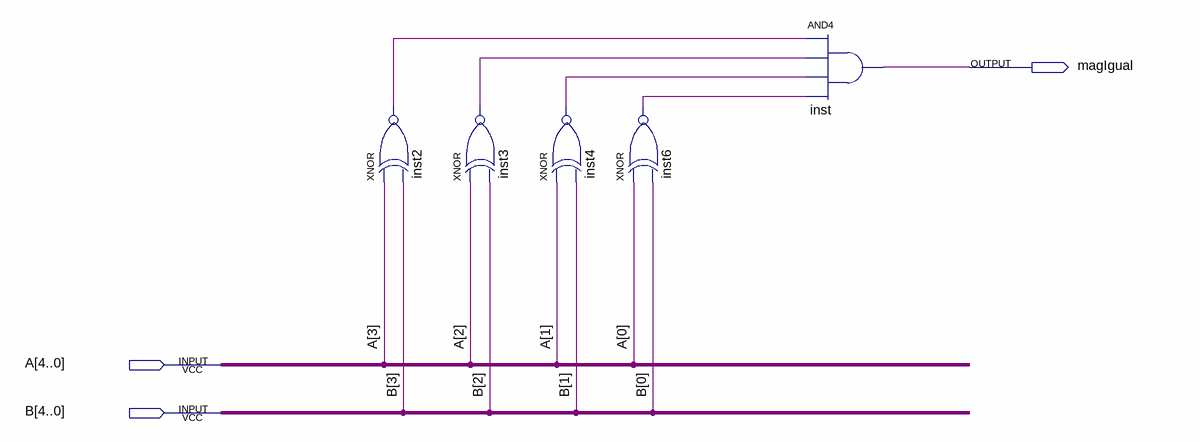
[diagram p0: schematic sheet]
// Quartus schematic CompararMagnitudeIgual.bdf as structural Verilog: 5 symbols, 3 pins
module CompararMagnitudeIgual (
  input  [4:0] A,
  input  [4:0] B,
  output magIgual
);

  wire inst2_out, inst3_out, inst4_out, inst6_out;

  xnor inst2 (inst2_out, A[3], B[3]);
  xnor inst3 (inst3_out, A[2], B[2]);
  xnor inst4 (inst4_out, A[1], B[1]);
  xnor inst6 (inst6_out, A[0], B[0]);
  and inst (magIgual, inst2_out, inst3_out, inst4_out, inst6_out);
endmodule
